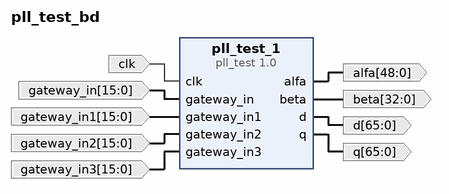
[diagram p0: block diagram of the top level]
# Vivado block design pll_test_bd, xc7z010clg400-1, Vivado 2017.2
create_bd_design pll_test_bd

create_bd_port -dir O -from 48 -to 0 -type data alfa
create_bd_port -dir O -from 32 -to 0 -type data beta
create_bd_port -dir I -type clk clk
create_bd_port -dir O -from 65 -to 0 -type data d
create_bd_port -dir I -from 15 -to 0 -type data gateway_in
create_bd_port -dir I -from 15 -to 0 -type data gateway_in1
create_bd_port -dir I -from 15 -to 0 -type data gateway_in2
create_bd_port -dir I -from 15 -to 0 -type data gateway_in3
create_bd_port -dir O -from 65 -to 0 -type data q

create_bd_cell -type ip -vlnv User_Company:SysGen:pll_test:1.0 pll_test_1

# ---- connections ----

connect_bd_net [get_bd_pins pll_test_1/alfa] [get_bd_ports alfa]
connect_bd_net [get_bd_pins pll_test_1/beta] [get_bd_ports beta]
connect_bd_net [get_bd_ports clk] [get_bd_pins pll_test_1/clk]
connect_bd_net [get_bd_pins pll_test_1/d] [get_bd_ports d]
connect_bd_net [get_bd_ports gateway_in] [get_bd_pins pll_test_1/gateway_in]
connect_bd_net -net gateway_in1_1 [get_bd_ports gateway_in1] [get_bd_pins pll_test_1/gateway_in1]
connect_bd_net -net gateway_in2_1 [get_bd_ports gateway_in2] [get_bd_pins pll_test_1/gateway_in2]
connect_bd_net -net gateway_in3_1 [get_bd_ports gateway_in3] [get_bd_pins pll_test_1/gateway_in3]
connect_bd_net [get_bd_pins pll_test_1/q] [get_bd_ports q]

validate_bd_design
save_bd_design
